# EAGLE design ia (EAGLE 9.3.0)
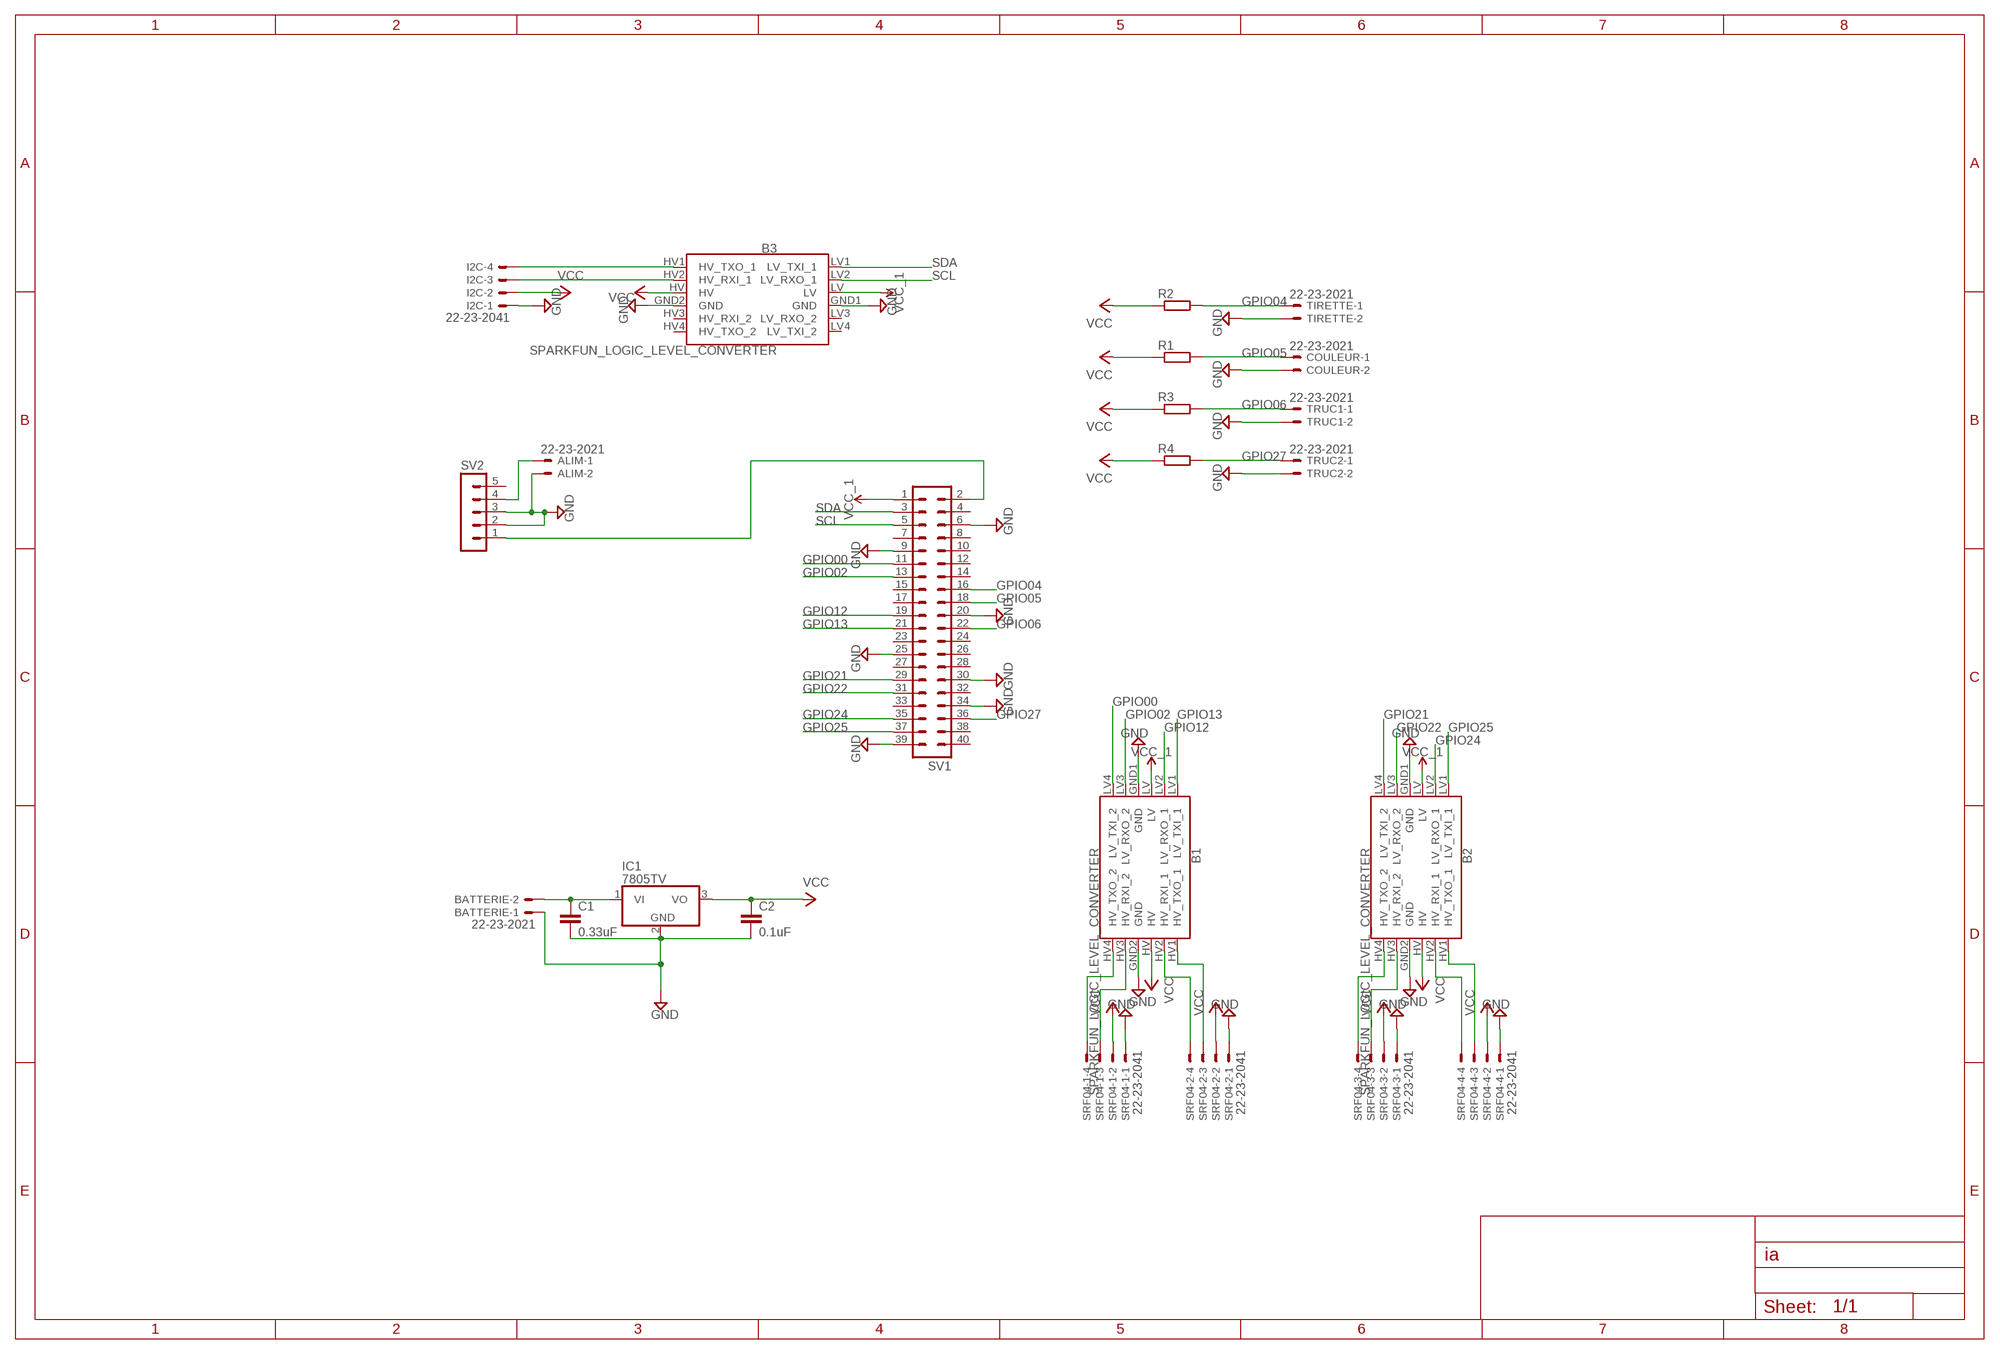
[diagram p0: schematic, sheet 1]

## Parts
ALIM  22-23-2021  [22-23-2021]
B1  SPARKFUN_LOGIC_LEVEL_CONVERTER  [SPARKFUN_LOGIC_LEVEL_CONVERTER]
B2  SPARKFUN_LOGIC_LEVEL_CONVERTER  [SPARKFUN_LOGIC_LEVEL_CONVERTER]
B3  SPARKFUN_LOGIC_LEVEL_CONVERTER  [SPARKFUN_LOGIC_LEVEL_CONVERTER]
BATTERIE  22-23-2021  [22-23-2021]
C1  0.33uF  C5/2.5  [C5B2.5]
C2  0.1uF  C5/2.5  [C5B2.5]
COULEUR  22-23-2021  [22-23-2021]
I2C  22-23-2041  [22-23-2041]
IC1  7805TV  [TO220V]
R1  R-EU_0207/15  [0207/15]
R2  R-EU_0207/15  [0207/15]
R3  R-EU_0207/15  [0207/15]
R4  R-EU_0207/15  [0207/15]
SRF04-1  22-23-2041  [22-23-2041]
SRF04-2  22-23-2041  [22-23-2041]
SRF04-3  22-23-2041  [22-23-2041]
SRF04-4  22-23-2041  [22-23-2041]
SV1  MA20-2  [MA20-2]
SV2  MA05-1  [MA05-1]
TIRETTE  22-23-2021  [22-23-2021]
TRUC1  22-23-2021  [22-23-2021]
TRUC2  22-23-2021  [22-23-2021]

## Nets
GND: ALIM.2 B1.GND1(GND) B1.GND2(GND) B2.GND1(GND) B2.GND2(GND) B3.GND1(GND) B3.GND2(GND) BATTERIE.1 C1.2 C2.2 COULEUR.2 I2C.1 IC1.2(GND) SRF04-1.1 SRF04-2.1 SRF04-3.1 SRF04-4.1 SV1.6 SV1.9 SV1.20 SV1.25 SV1.30 SV1.34 SV1.39 SV2.2 SV2.3 TIRETTE.2 TRUC1.2 TRUC2.2
GPIO00: B1.LV4(LV_TXI_2) SV1.11
GPIO02: B1.LV3(LV_RXO_2) SV1.13
GPIO04: R2.2 SV1.16 TIRETTE.1
GPIO05: COULEUR.1 R1.2 SV1.18
GPIO06: R3.2 SV1.22 TRUC1.1
GPIO12: B1.LV2(LV_RXO_1) SV1.19
GPIO13: B1.LV1(LV_TXI_1) SV1.21
GPIO21: B2.LV4(LV_TXI_2) SV1.29
GPIO22: B2.LV3(LV_RXO_2) SV1.31
GPIO24: B2.LV2(LV_RXO_1) SV1.35
GPIO25: B2.LV1(LV_TXI_1) SV1.37
GPIO27: R4.2 SV1.36 TRUC2.1
N$1: B1.HV2(HV_RXI_1) SRF04-2.4
N$2: B1.HV1(HV_TXO_1) SRF04-2.3
N$3: B1.HV3(HV_RXI_2) SRF04-1.3
N$4: B1.HV4(HV_TXO_2) SRF04-1.4
N$5: B2.HV2(HV_RXI_1) SRF04-4.4
N$6: B2.HV1(HV_TXO_1) SRF04-4.3
N$7: B2.HV3(HV_RXI_2) SRF04-3.3
N$8: B2.HV4(HV_TXO_2) SRF04-3.4
N$9: BATTERIE.2 C1.1 IC1.1(VI)
N$10: B3.HV2(HV_RXI_1) I2C.3
N$11: B3.HV1(HV_TXO_1) I2C.4
N$13: SV1.2 SV2.1
N$14: ALIM.1 SV2.4
SCL: B3.LV2(LV_RXO_1) SV1.5
SDA: B3.LV1(LV_TXI_1) SV1.3
VCC: B1.HV B2.HV B3.HV C2.1 I2C.2 IC1.3(VO) R1.1 R2.1 R3.1 R4.1 SRF04-1.2 SRF04-2.2 SRF04-3.2 SRF04-4.2
VCC_1: B1.LV B2.LV B3.LV SV1.1
Unconnected: B3.HV3(HV_RXI_2) B3.HV4(HV_TXO_2) B3.LV3(LV_RXO_2) B3.LV4(LV_TXI_2) SV1.4 SV1.7 SV1.8 SV1.10 SV1.12 SV1.14 SV1.15 SV1.17 SV1.23 SV1.24 SV1.26 SV1.27 SV1.28 SV1.32 SV1.33 SV1.38 SV1.40 SV2.5

## Library data of the parts
ALIM BATTERIE COULEUR TIRETTE TRUC1 TRUC2 = con-molex:22-23-2021: .100" (2.54mm) Center Header - 2 Pin; MF: MOLEX; MPN: 22-23-2021; OC_FARNELL: 1462926; OC_NEWARK: 25C3832
B1-B3 = SparkFun-Boards:SPARKFUN_LOGIC_LEVEL_CONVERTER: SparkFun Logic Level Converter -Bi-Directional This is the mechnical outline for the 3.3V - 5V bi directional logic level converter. *Note, the "LOCK" Package has the header pins staggered by an offset of 5 mils (off center line), so that when you slide a row of standard 0.1" headers into the PTH pads, it will hold position vertically. See the follwing turorial for more information on this type of special footprints: Sneaky Footprints <https://www.sparkfun.com/tutorials/114> SparkFun Products: SparkFun Logic Level Converter - Bi-Directional <https://www.sparkfun.com/products/12009>
C1 C2 = capacitor-wima:C: CAPACITOR naming: grid - package width
I2C SRF04-1-SRF04-4 = con-molex:22-23-2041: .100" (2.54mm) Center Header - 4 Pin; MF: MOLEX; MPN: 22-23-2041; OC_FARNELL: 1462920; OC_NEWARK: 38C0355
IC1 = linear:78*: Positive VOLTAGE REGULATOR Source: http://cache.national.com/ds/LM/LM78L05.pdf http://www.fairchildsemi.com/ds/LM/LM7805.pdf
R1-R4 = rcl:R-EU_: RESISTOR, European symbol; SPICEPREFIX: R
SV1 = con-lstb:MA20-2: PIN HEADER; OC_FARNELL: unknown; OC_NEWARK: unknown
SV2 = con-lstb:MA05-1: PIN HEADER; OC_FARNELL: unknown; OC_NEWARK: unknown

## Board
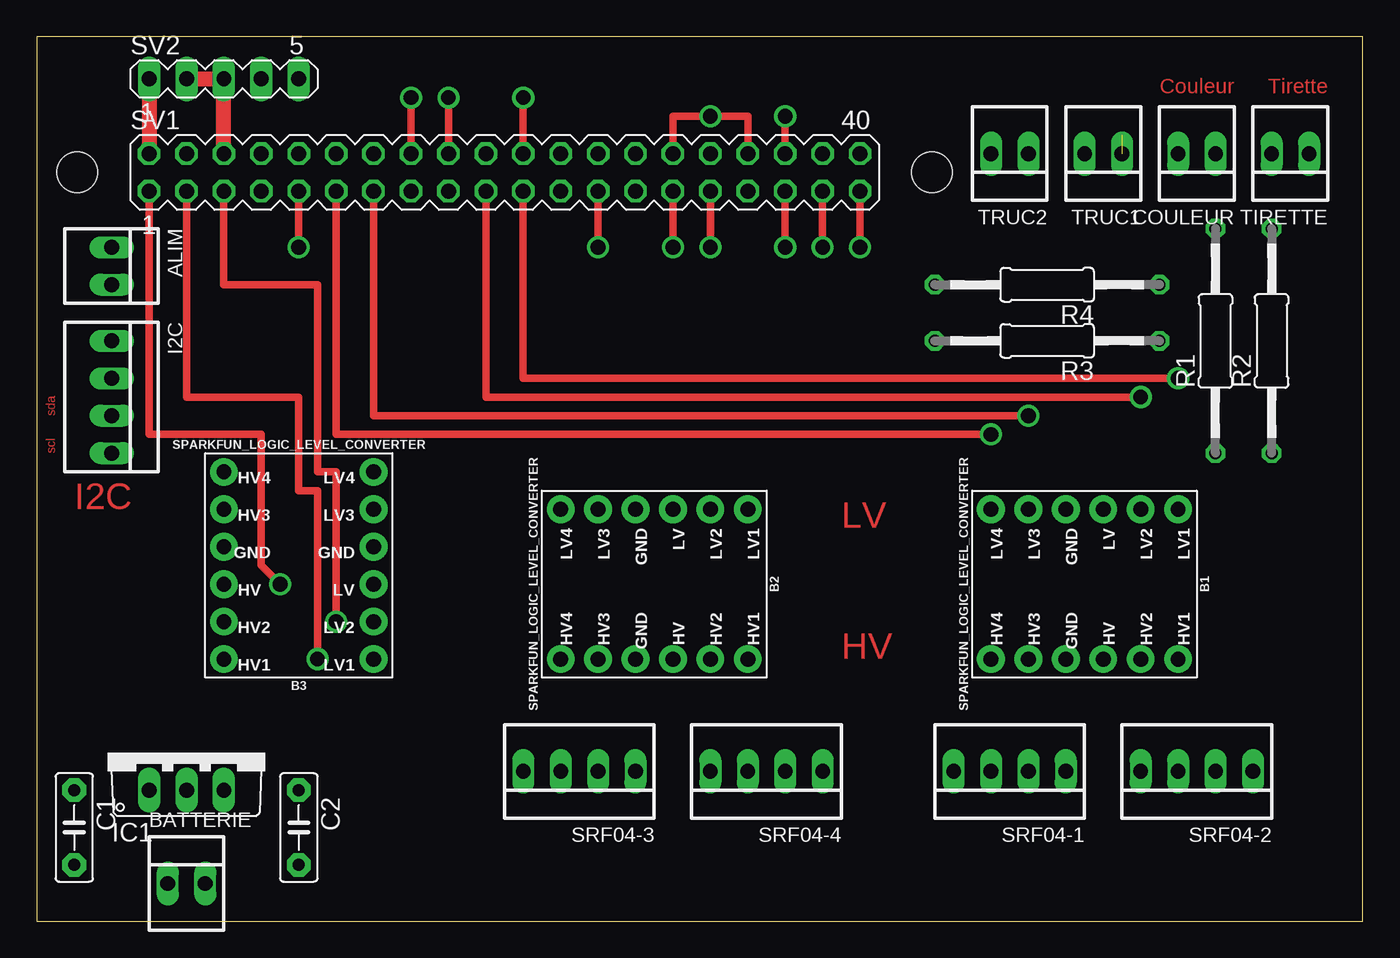
[diagram p1: board, top side]
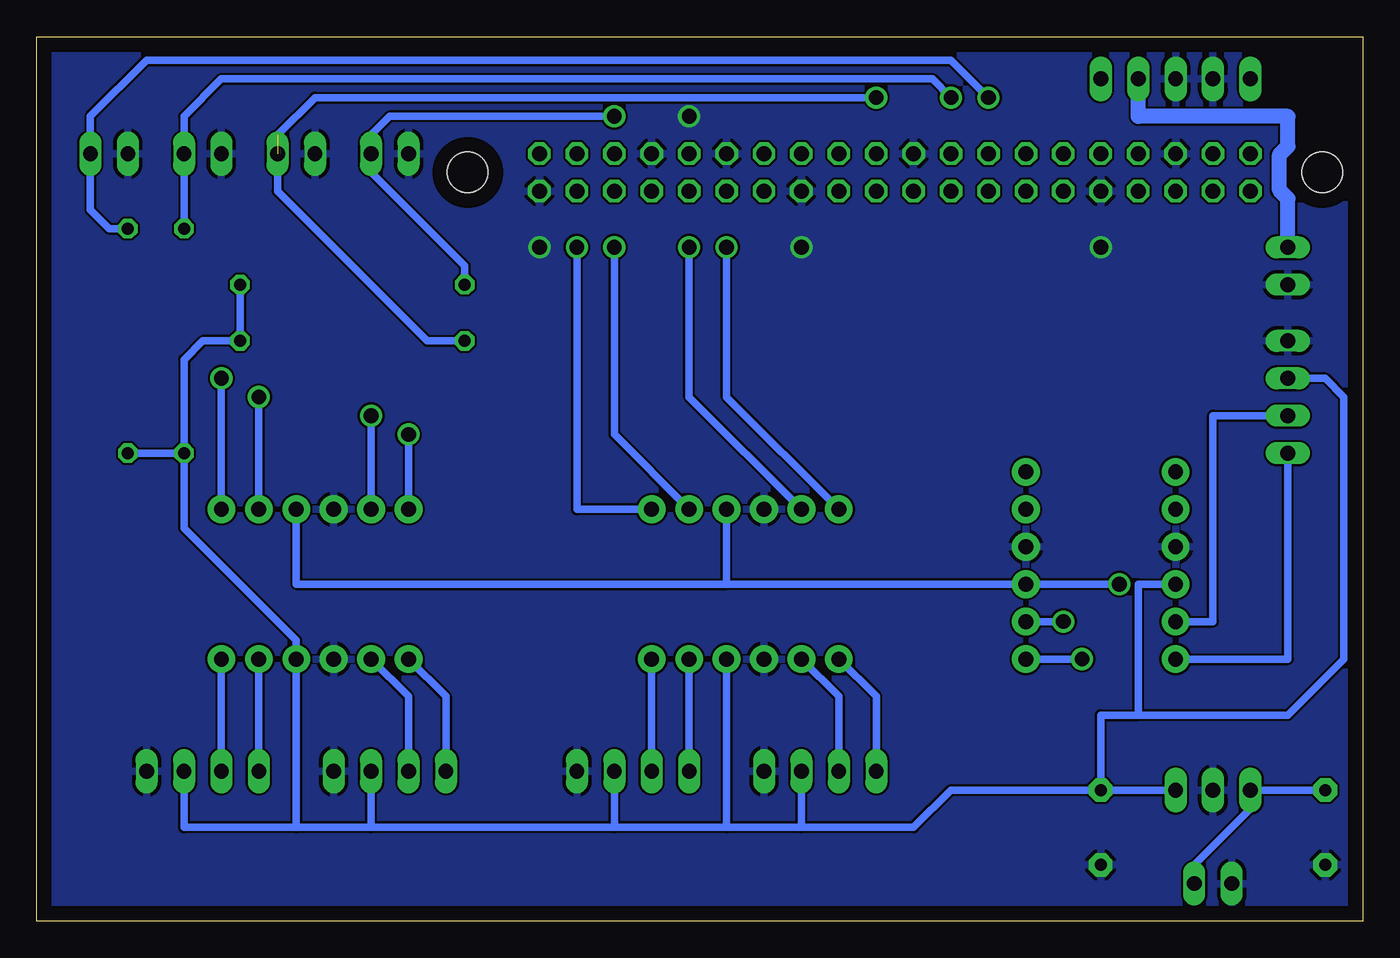
[diagram p2: board, bottom side, seen from below]

Size 90 x 60 mm. Coordinates in mm from the lower left corner, seen from the top.
Outline: 0,0 90,0 90,60 0,60 0,0
Copper layers (1*16): Top 0.035mm / dielectric 1.5mm / Bottom 0.035mm
Design rules "default": minimum track width 6mil, minimum drill 0.35mm, track to track 6mil, track to pad 6mil, pad to pad 6mil, via to via 6mil, smd to smd 6mil, copper to edge 40mil, drill to drill 6mil, minimum pad ring 10mil, minimum via ring 8mil, stop-mask expansion 4mil, vias tented up to drill 0mil, thermal gap 10mil
Holes 2.75 mm at 2.75,50.8 60.75,50.8

### Footprints (pad centres in the part's own frame; a part is rotated, then mirrored left to right if it is on the bottom)
22-23-2021 = drill 1 long: 1 -1.27,0; 2 1.27,0
SPARKFUN_LOGIC_LEVEL_CONVERTER = drill 1.016 pad 1.88: GND1 -5.08,-1.27; GND2 5.08,-1.27; HV 5.08,1.27; HV1 5.08,6.35; HV2 5.08,3.81; HV3 5.08,-3.81; HV4 5.08,-6.35; LV -5.08,1.27; LV1 -5.08,6.35; LV2 -5.08,3.81; LV3 -5.08,-3.81; LV4 -5.08,-6.35
C5B2.5 = drill 0.813 pad 1.6 octagon: 1 -2.54,0; 2 2.54,0
22-23-2041 = drill 1 long: 1 -3.81,0; 2 -1.27,0; 3 1.27,0; 4 3.81,0
TO220V = drill 1.016 long: 1 -2.54,-2.54; 2 0,-2.54; 3 2.54,-2.54
0207/15 = drill 0.813 octagon: 1 -7.62,0; 2 7.62,0
MA20-2 = drill 1.016 octagon: 1 -24.13,-1.27; 2 -24.13,1.27; 3 -21.59,-1.27; 4 -21.59,1.27; 5 -19.05,-1.27; 6 -19.05,1.27; 7 -16.51,-1.27; 8 -16.51,1.27; 9 -13.97,-1.27; 10 -13.97,1.27; 11 -11.43,-1.27; 12 -11.43,1.27; 13 -8.89,-1.27; 14 -8.89,1.27; 15 -6.35,-1.27; 16 -6.35,1.27; 17 -3.81,-1.27; 18 -3.81,1.27; 19 -1.27,-1.27; 20 -1.27,1.27; 21 1.27,-1.27; 22 1.27,1.27; 23 3.81,-1.27; 24 3.81,1.27; 25 6.35,-1.27; 26 6.35,1.27; 27 8.89,-1.27; 28 8.89,1.27; 29 11.43,-1.27; 30 11.43,1.27; 31 13.97,-1.27; 32 13.97,1.27; 33 16.51,-1.27; 34 16.51,1.27; 35 19.05,-1.27; 36 19.05,1.27; 37 21.59,-1.27; 38 21.59,1.27; 39 24.13,-1.27; 40 24.13,1.27
MA05-1 = drill 1.016 long: 1 -5.08,0; 2 -2.54,0; 3 0,0; 4 2.54,0; 5 5.08,0

### Placement (x,y rotation side)
ALIM  5.08,44.45 270 top
B1  71.12,22.86 270 top
B2  41.91,22.86 270 top
B3  17.78,24.13 180 top
BATTERIE  10.16,2.54 0 top
C1  2.54,6.35 270 top
C2  17.78,6.35 270 top
COULEUR  78.74,52.07 180 top
I2C  5.08,35.56 270 top
IC1  10.16,11.43 0 top
R1  80.01,39.37 90 top
R2  83.82,39.37 90 top
R3  68.58,39.37 180 top
R4  68.58,43.18 180 top
SRF04-1  66.04,10.16 180 top
SRF04-2  78.74,10.16 180 top
SRF04-3  36.83,10.16 180 top
SRF04-4  49.53,10.16 180 top
SV1  31.75,50.8 0 top
SV2  12.7,57.15 0 top
TIRETTE  85.09,52.07 180 top
TRUC1  72.39,52.07 180 top
TRUC2  66.04,52.07 180 top

### Tracks (layer width: path | path; a pad name or v marks a point on that pad's centre or on a via)
GND  (via drill 1)
  Top 0.508: SV1.39 v55.88,45.72 | v38.1,45.72 SV1.25 | SV1.30 43.18,54.61 v45.72,54.61 48.26,54.61 SV1.34 | v17.78,45.72 SV1.9
  Top 1.016: SV1.6 SV2.3 SV2.2
  pour Bottom: 0,0 0,59.69 90.17,59.69 90.17,0
GPIO00  (via drill 1)
  Top 0.508: SV1.11 20.32,33.02 v64.77,33.02
  Bottom 0.508: v64.77,33.02 B1.LV4
GPIO02  (via drill 1)
  Top 0.508: SV1.13 22.86,34.29 v67.31,34.29
  Bottom 0.508: v67.31,34.29 B1.LV3
GPIO04  (via drill 1)
  Top 0.508: SV1.16 v25.4,55.88
  Bottom 0.508: v25.4,55.88 27.94,58.42 82.55,58.42 86.36,54.61 TIRETTE.1 86.36,48.26 85.09,46.99 R2.2
GPIO05  (via drill 1)
  Top 0.508: SV1.18 v27.94,55.88
  Bottom 0.508: v27.94,55.88 29.21,57.15 77.47,57.15 80.01,54.61 COULEUR.1 R1.2
GPIO06  (via drill 1)  (1 unrouted)
  Top 0.508: SV1.22 v33.02,55.88
  Bottom 0.508: 73.66,53.34 71.12,55.88 v33.02,55.88 | TRUC1.1 73.66,49.53 63.5,39.37 R3.2
GPIO12  (via drill 1)
  Top 0.508: v74.93,35.56 30.48,35.56 SV1.19
  Bottom 0.508: v74.93,35.56 B1.LV2
GPIO13  (via drill 1)
  Top 0.508: SV1.21 33.02,36.83 v77.47,36.83
  Bottom 0.508: v77.47,36.83 B1.LV1
GPIO21  (via drill 1)
  Top 0.508: v43.18,45.72 SV1.29
  Bottom 0.508: B2.LV4 43.18,35.56 v43.18,45.72
GPIO22  (via drill 1)
  Top 0.508: v45.72,45.72 SV1.31
  Bottom 0.508: B2.LV3 45.72,35.56 v45.72,45.72
GPIO24  (via drill 1)
  Top 0.508: v50.8,45.72 SV1.35
  Bottom 0.508: B2.LV2 50.8,33.02 v50.8,45.72
GPIO25  (via drill 1)
  Top 0.508: v53.34,45.72 SV1.37
  Bottom 0.508: B2.LV1 53.34,27.94 v53.34,45.72
GPIO27  (via drill 1)
  Top 0.508: SV1.36 v50.8,54.61
  Bottom 0.508: v50.8,54.61 66.04,54.61 67.31,53.34 TRUC2.1 67.31,50.8 60.96,44.45 R4.2
N$1
  Bottom 0.508: B1.HV2 SRF04-2.4
N$2
  Bottom 0.508: B1.HV1 SRF04-2.3
N$3
  Bottom 0.508: B1.HV3 64.77,15.24 SRF04-1.3
N$4
  Bottom 0.508: B1.HV4 62.23,15.24 SRF04-1.4
N$5
  Bottom 0.508: SRF04-4.4 B2.HV2
N$6
  Bottom 0.508: SRF04-4.3 B2.HV1
N$7
  Bottom 0.508: B2.HV3 35.56,15.24 SRF04-3.3
N$8
  Bottom 0.508: SRF04-3.4 33.02,15.24 B2.HV4
N$9
  Bottom 0.508: C1.1 IC1.1 7.62,7.62 11.43,3.81 BATTERIE.2
N$10
  Bottom 0.508: B3.HV2 10.16,20.32 10.16,34.29 I2C.3
N$11
  Bottom 0.508: B3.HV1 5.08,17.78 I2C.4
N$13
  Top 1.016: SV2.1 SV1.2
N$14
  Bottom 1.016: ALIM.1 5.08,49.03 5.65,49.6 5.65,52 5.08,52.57 5.08,54.61 15.24,54.61 SV2.4
SCL  (via drill 1)
  Top 0.508: SV1.5 12.7,43.18 19.05,43.18 19.05,30.48 20.32,30.48 v20.32,20.32
  Bottom 0.508: v20.32,20.32 B3.LV2
SDA  (via drill 1)
  Top 0.508: v19.05,17.78 19.05,29.21 17.78,29.21 17.78,35.56 10.16,35.56 SV1.3
  Bottom 0.508: v19.05,17.78 B3.LV1
VCC
  Bottom 0.508: C2.1 IC1.3 | C2.1 27.94,8.89 30.48,6.35 38.1,6.35 | 38.1,6.35 SRF04-3.2 | 38.1,6.35 43.18,6.35 | 43.18,6.35 50.8,6.35 | 50.8,6.35 SRF04-4.2 | 50.8,6.35 67.31,6.35 | 67.31,6.35 SRF04-1.2 | 67.31,6.35 72.39,6.35 | 72.39,6.35 80.01,6.35 SRF04-2.2 | B2.HV 43.18,6.35 | 72.39,6.35 B1.HV 72.39,19.05 80.01,26.67 R1.1 | I2C.2 2.54,36.83 1.27,35.56 1.27,17.78 5.08,13.97 15.24,13.97 | R4.1 R3.1 78.74,39.37 80.01,38.1 R1.1 | R2.1 R1.1 | 15.24,13.97 15.24,22.86 B3.HV | C2.1 17.78,13.97 15.24,13.97
VCC_1  (via drill 1)
  Top 0.508: v16.51,22.86 15.24,24.13 15.24,33.02 7.62,33.02 SV1.1
  Bottom 0.508: B1.LV 72.39,22.86 43.18,22.86 | 43.18,22.86 B2.LV | v16.51,22.86 B3.LV 43.18,22.86

### Text on the board
Top: Couleur | Tirette | sda | scl | I2C | LV | HV